# Altium schematic sheet Dual 5V+3.3V Switch Mode PSU.SchDoc
size A4
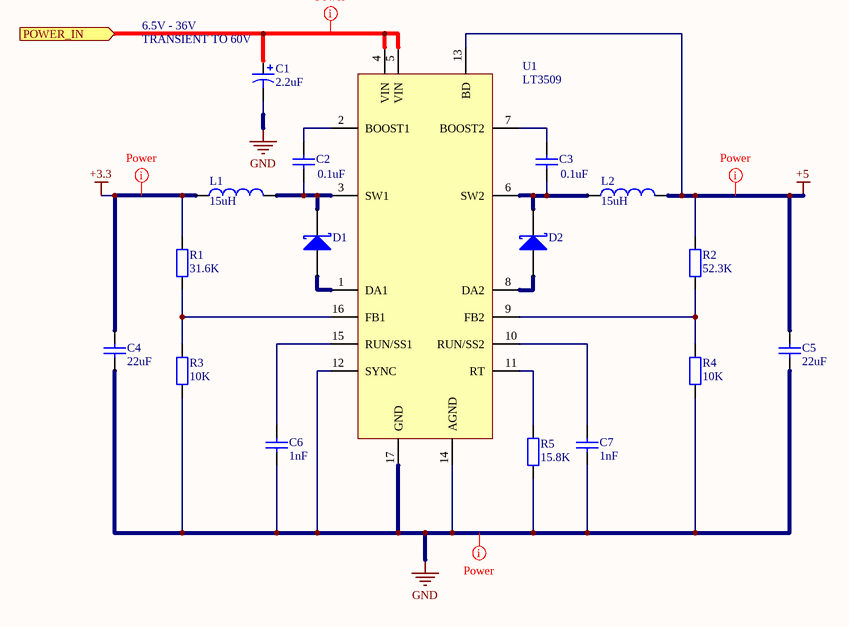
[diagram p0: Dual 5V+3.3V Switch Mode PSU.SchDoc]

## Parts
C1  value 2.2uF  [EEEHC1H2R2R]  (hidden comment: Cap Pol1)
C2  value 0.1uF  [C0603]  (hidden comment: Cap)
C3  value 0.1uF  [C0603]  (hidden comment: Cap)
C4  value 22uF  [C0805]  (hidden comment: Cap)
C5  value 22uF  [C0805]  (hidden comment: Cap)
C6  value 1nF  [C0603]  (hidden comment: Cap)
C7  value 1nF  [C0603]  (hidden comment: Cap)
D1  D Schottky  [VS-10BQ030TRPBF]  (value not drawn)
D2  D Schottky  [VS-10BQ030TRPBF]  (value not drawn)
L1  value 15uH  [SDR0604-150YL]  (hidden comment: Inductor)
L2  value 15uH  [SDR0604-150YL]  (hidden comment: Inductor)
R1  value 31.6K  [R0603]  (hidden comment: Res)
R2  value 52.3K  [R0603]  (hidden comment: Res)
R3  value 10K  [R0603]  (hidden comment: Res)
R4  value 10K  [R0603]  (hidden comment: Res)
R5  value 15.8K  [R0603]  (hidden comment: Res)
U1  LT3509  [LT3509]

## Ports
POWER_IN (in)

## Nets
+3.3: C4.1 L1.1 R1.2
+5: C5.1 L2.2 R2.2 U1.13(BD)
GND: C1.2 C4.2 C5.2 C6.2 C7.2 R3.1 R4.1 R5.1 U1.12(SYNC) U1.14(AGND) U1.17(GND)
POWER_IN: C1.1 U1.4(VIN) U1.5(VIN) ; port POWER_IN
NetC2_1: C2.1 D1.2(K) L1.2 U1.3(SW1)
NetC2_2: C2.2 U1.2(BOOST1)
NetC3_1: C3.1 D2.2(K) L2.1 U1.6(SW2)
NetC3_2: C3.2 U1.7(BOOST2)
NetC6_1: C6.1 U1.15(RUN/SS1)
NetC7_1: C7.1 U1.10(RUN/SS2)
NetD1_1: D1.1(A) U1.1(DA1)
NetD2_1: D2.1(A) U1.8(DA2)
NetR1_1: R1.1 R3.2 U1.16(FB1)
NetR2_1: R2.1 R4.2 U1.9(FB2)
NetR5_2: R5.2 U1.11(RT)

## Layout directives
net class Power: +3.3, +5, GND, POWER_IN

## Notes on the sheet
- 6.5V - 36V
- (near C1) TRANSIENT TO 60V

## Library data of the parts
C1 = Cap Pol1: Polarized Capacitor (Radial); Published: 8-Jun-2000; LatestRevisionDate: 17-Jul-2002; LatestRevisionNote: Re-released for DXP Platform.; PackageReference: RB7.6-15; Publisher: Altium Limited; farnell: 1714713
C2-C7 = Cap: Capacitor
  C2 C3: Published: 8-Jun-2000; LatestRevisionDate: 17-Jul-2002; LatestRevisionNote: Re-released for DXP Platform.; PackageReference: RAD-0.3; Publisher: Altium Limited; farnell: 9406140
  C4 C5: farnell: 1867955
  C6 C7: farnell: 1759088
D1 D2 = D Schottky: Schottky Diode; Published: 8-Jun-2000; LatestRevisionDate: 17-Jul-2002; LatestRevisionNote: Re-released for DXP Platform.; PackageReference: SMB; Publisher: Altium Limited; Code_JEDEC: DO-214-AA; farnell: 9100687
L1 L2 = Inductor: Code_IEC: 1005; Published: 8-Jun-2000; LatestRevisionDate: 29-May-2009; LatestRevisionNote: IPC-7351 Footprint Added.; PackageReference: 0402-A; Publisher: Altium Limited; PackageDescription: Chip Inductor; Code_JEITA: 0402; farnell: 1828004
R1-R5 = Res2: Resistor
  R1: farnell: 1170937
  R2: farnell: 1170957
  R3 R4: farnell: 1576297
  R5: farnell: 1170905
U1 = LT3509: digikey: LT3509EMSE#PBF-ND